# Altium project Furious_FFT.PrjPcb
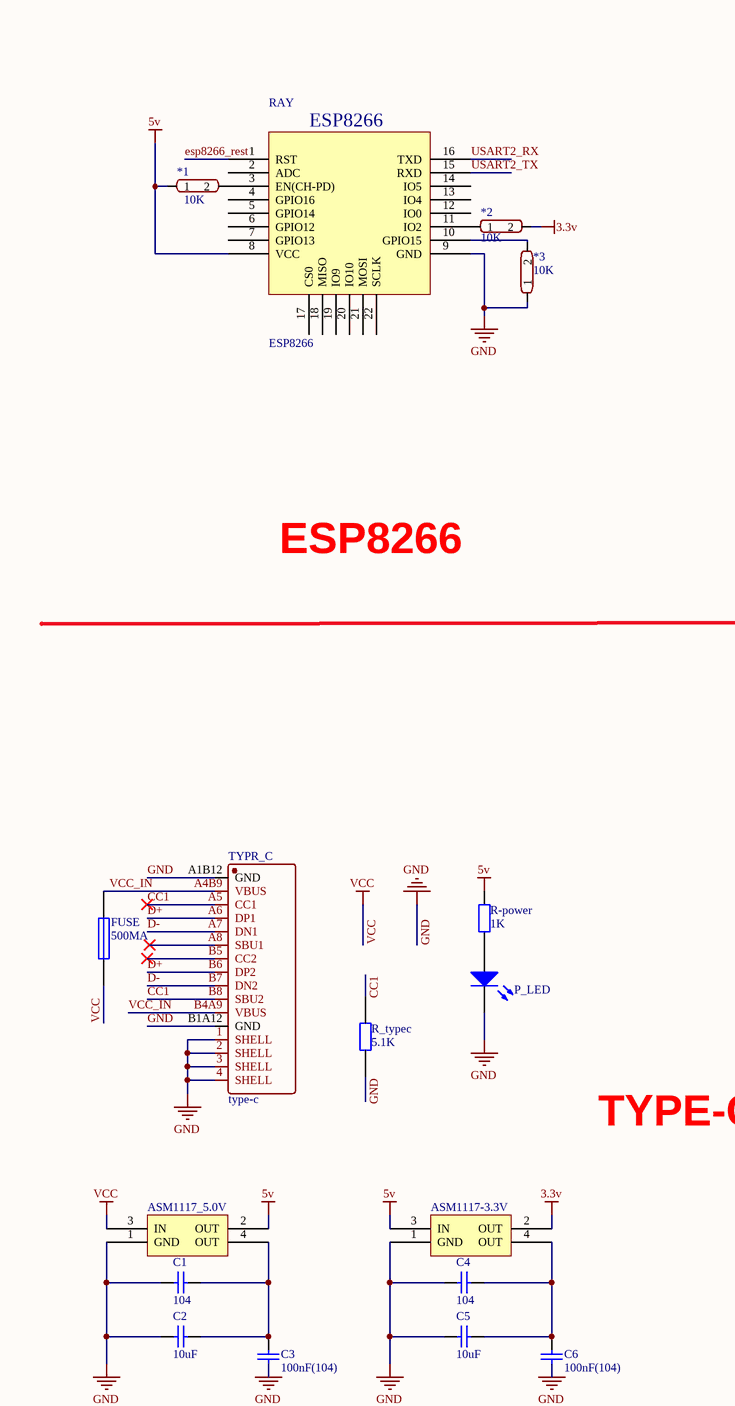
[diagram p0: Verison_1.0.SchDoc, top left]
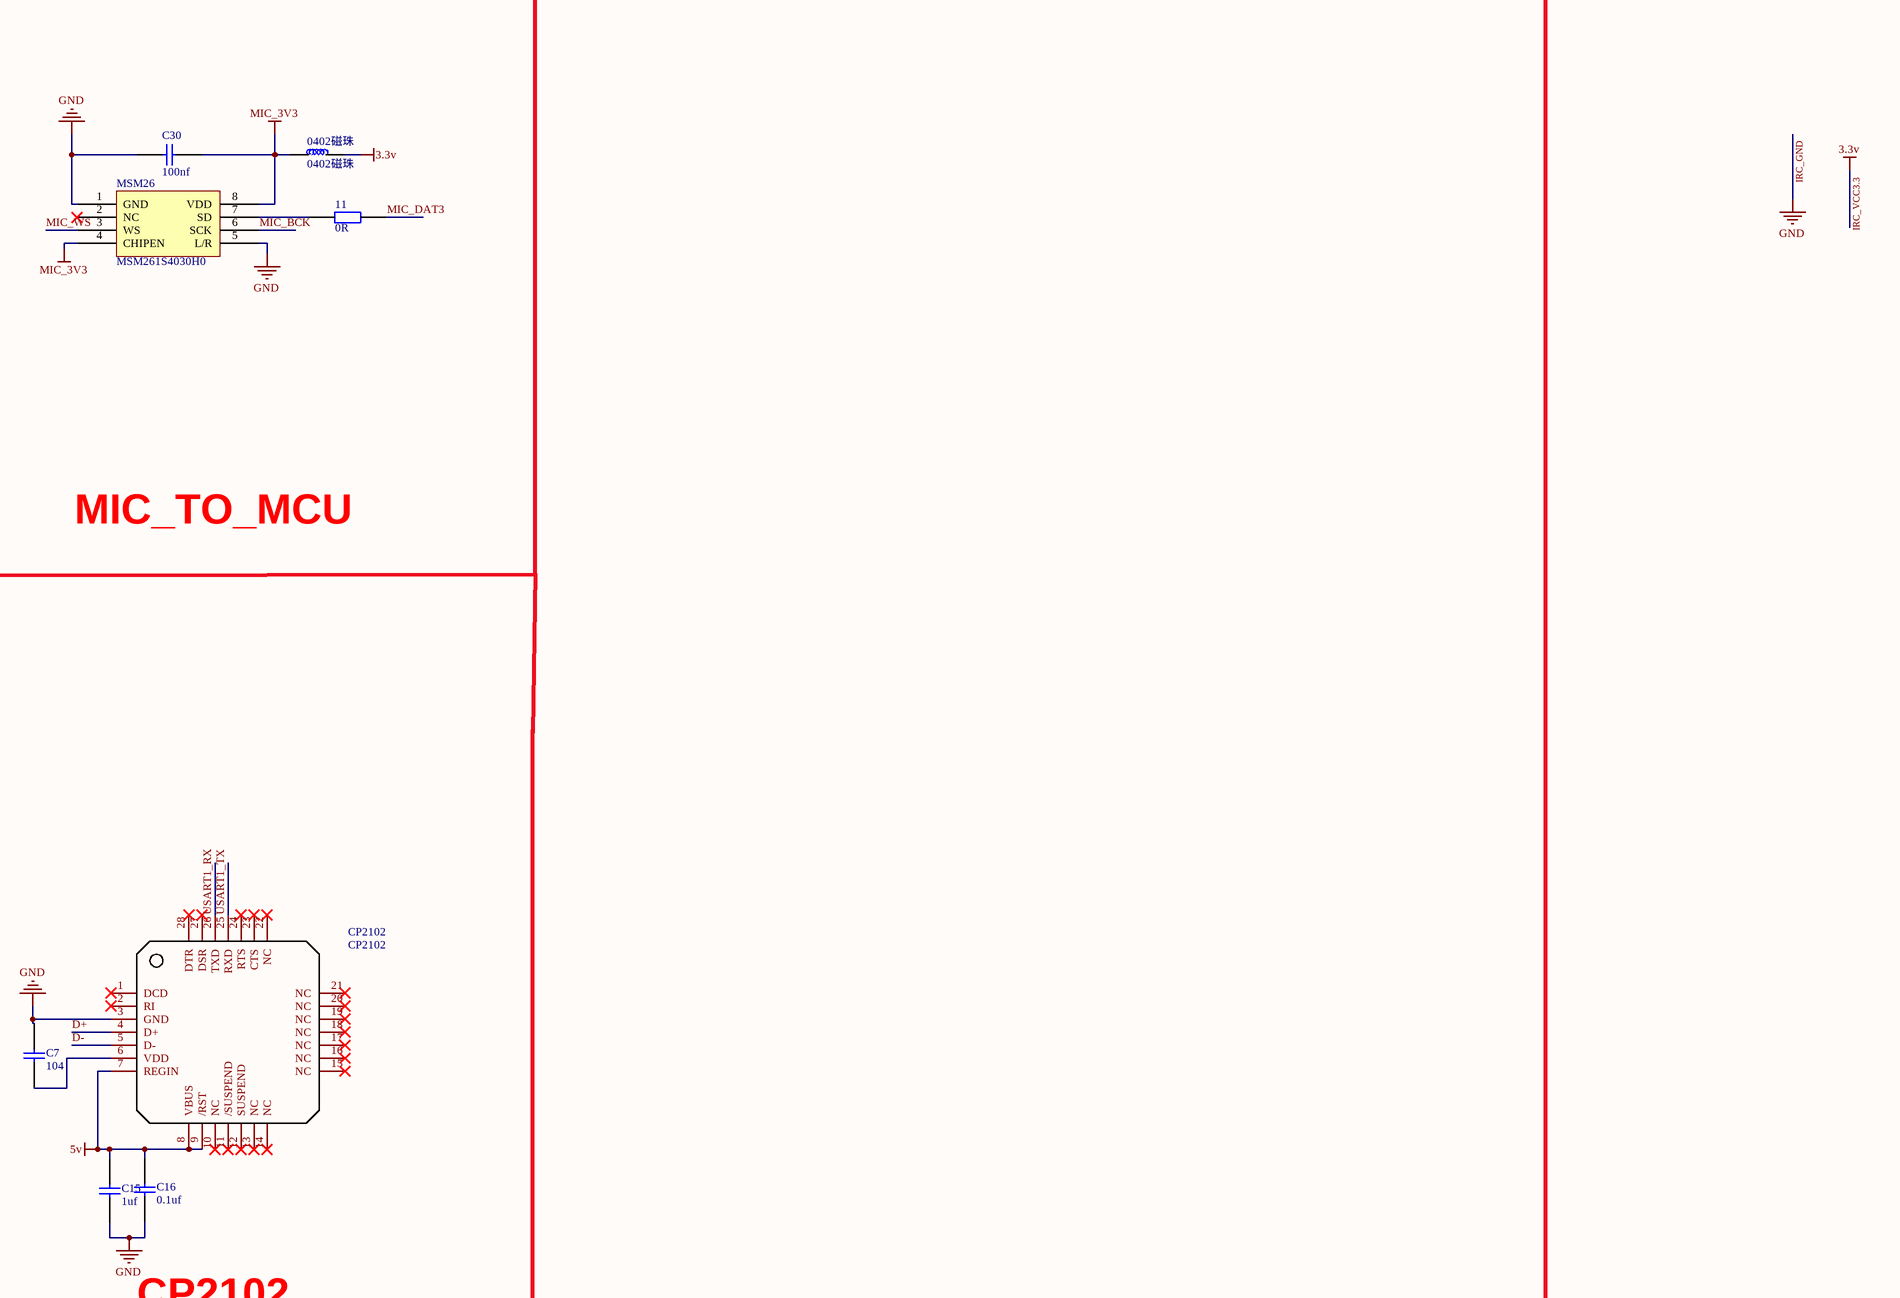
[diagram p1: Verison_1.0.SchDoc, top middle]
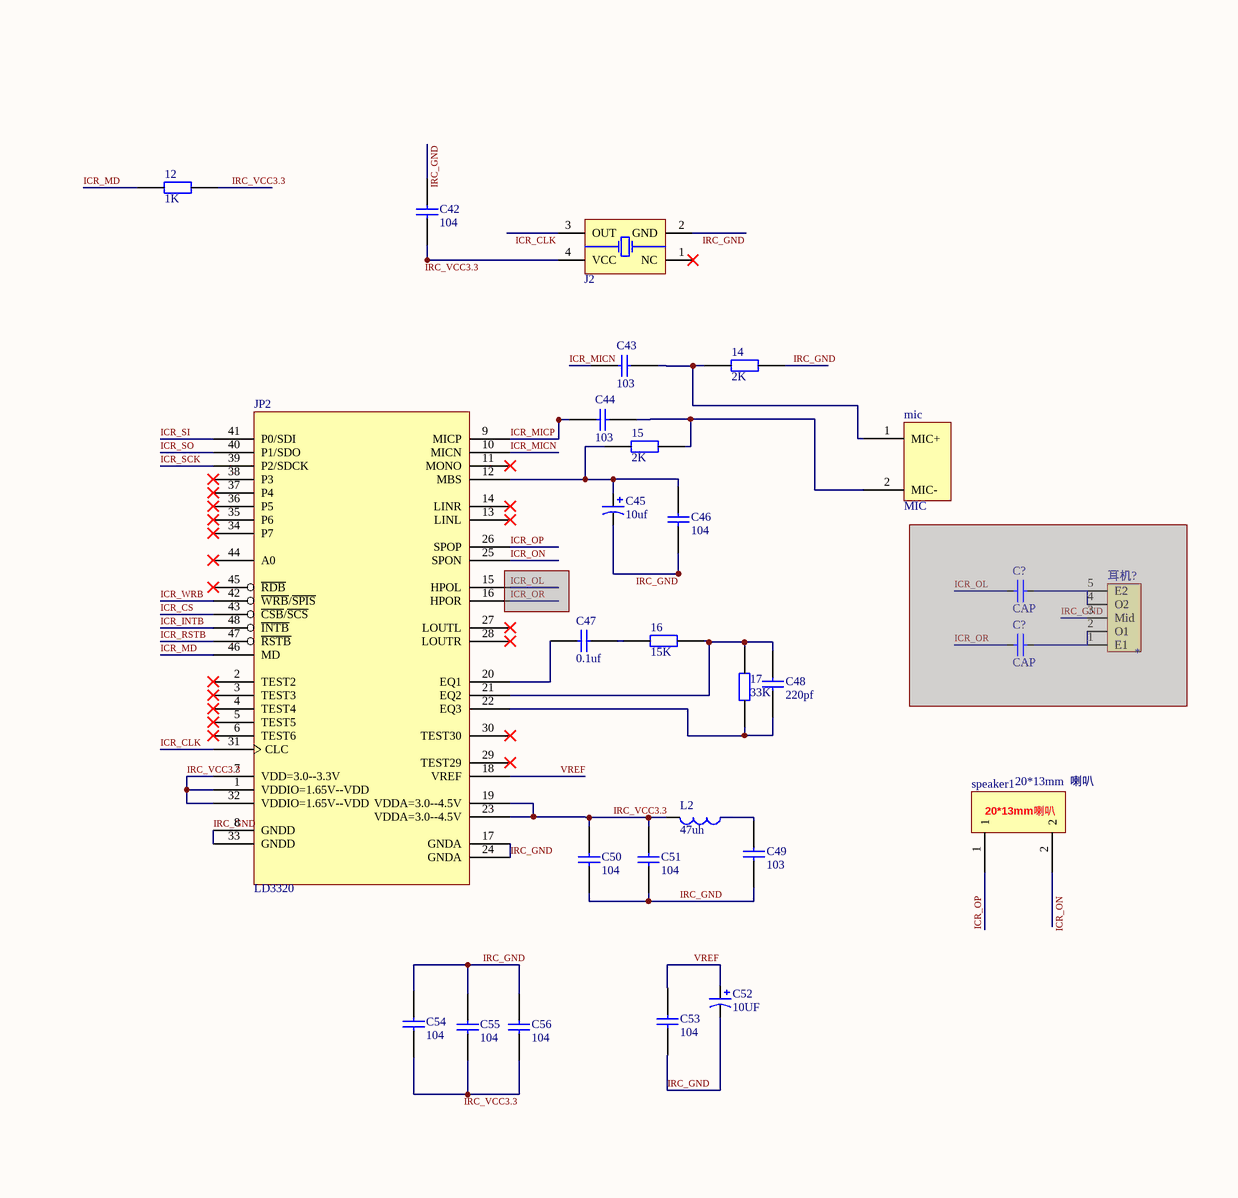
[diagram p2: Verison_1.0.SchDoc, top right]
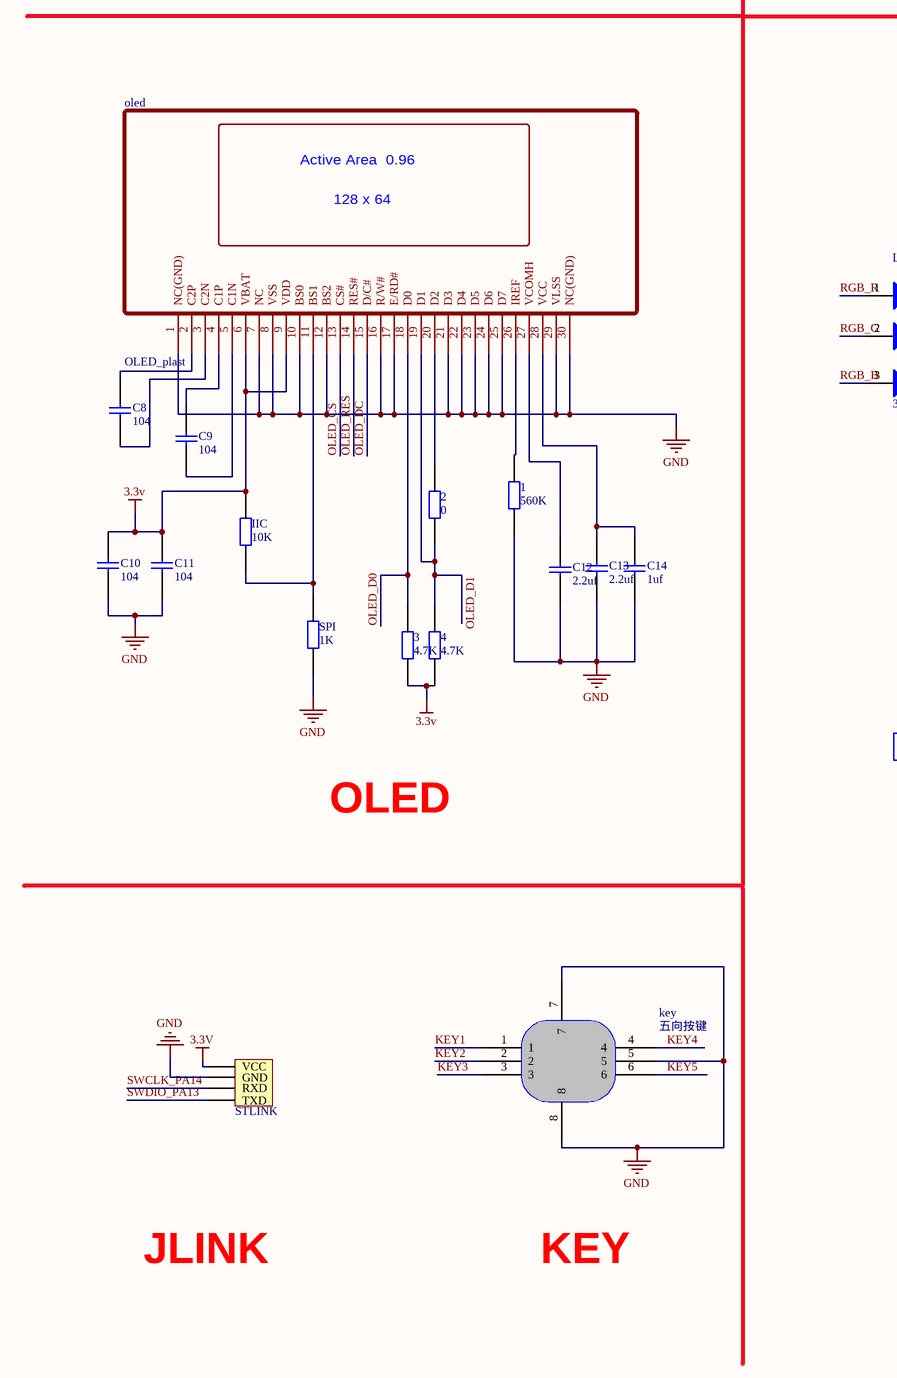
[diagram p3: Verison_1.0.SchDoc, bottom left]
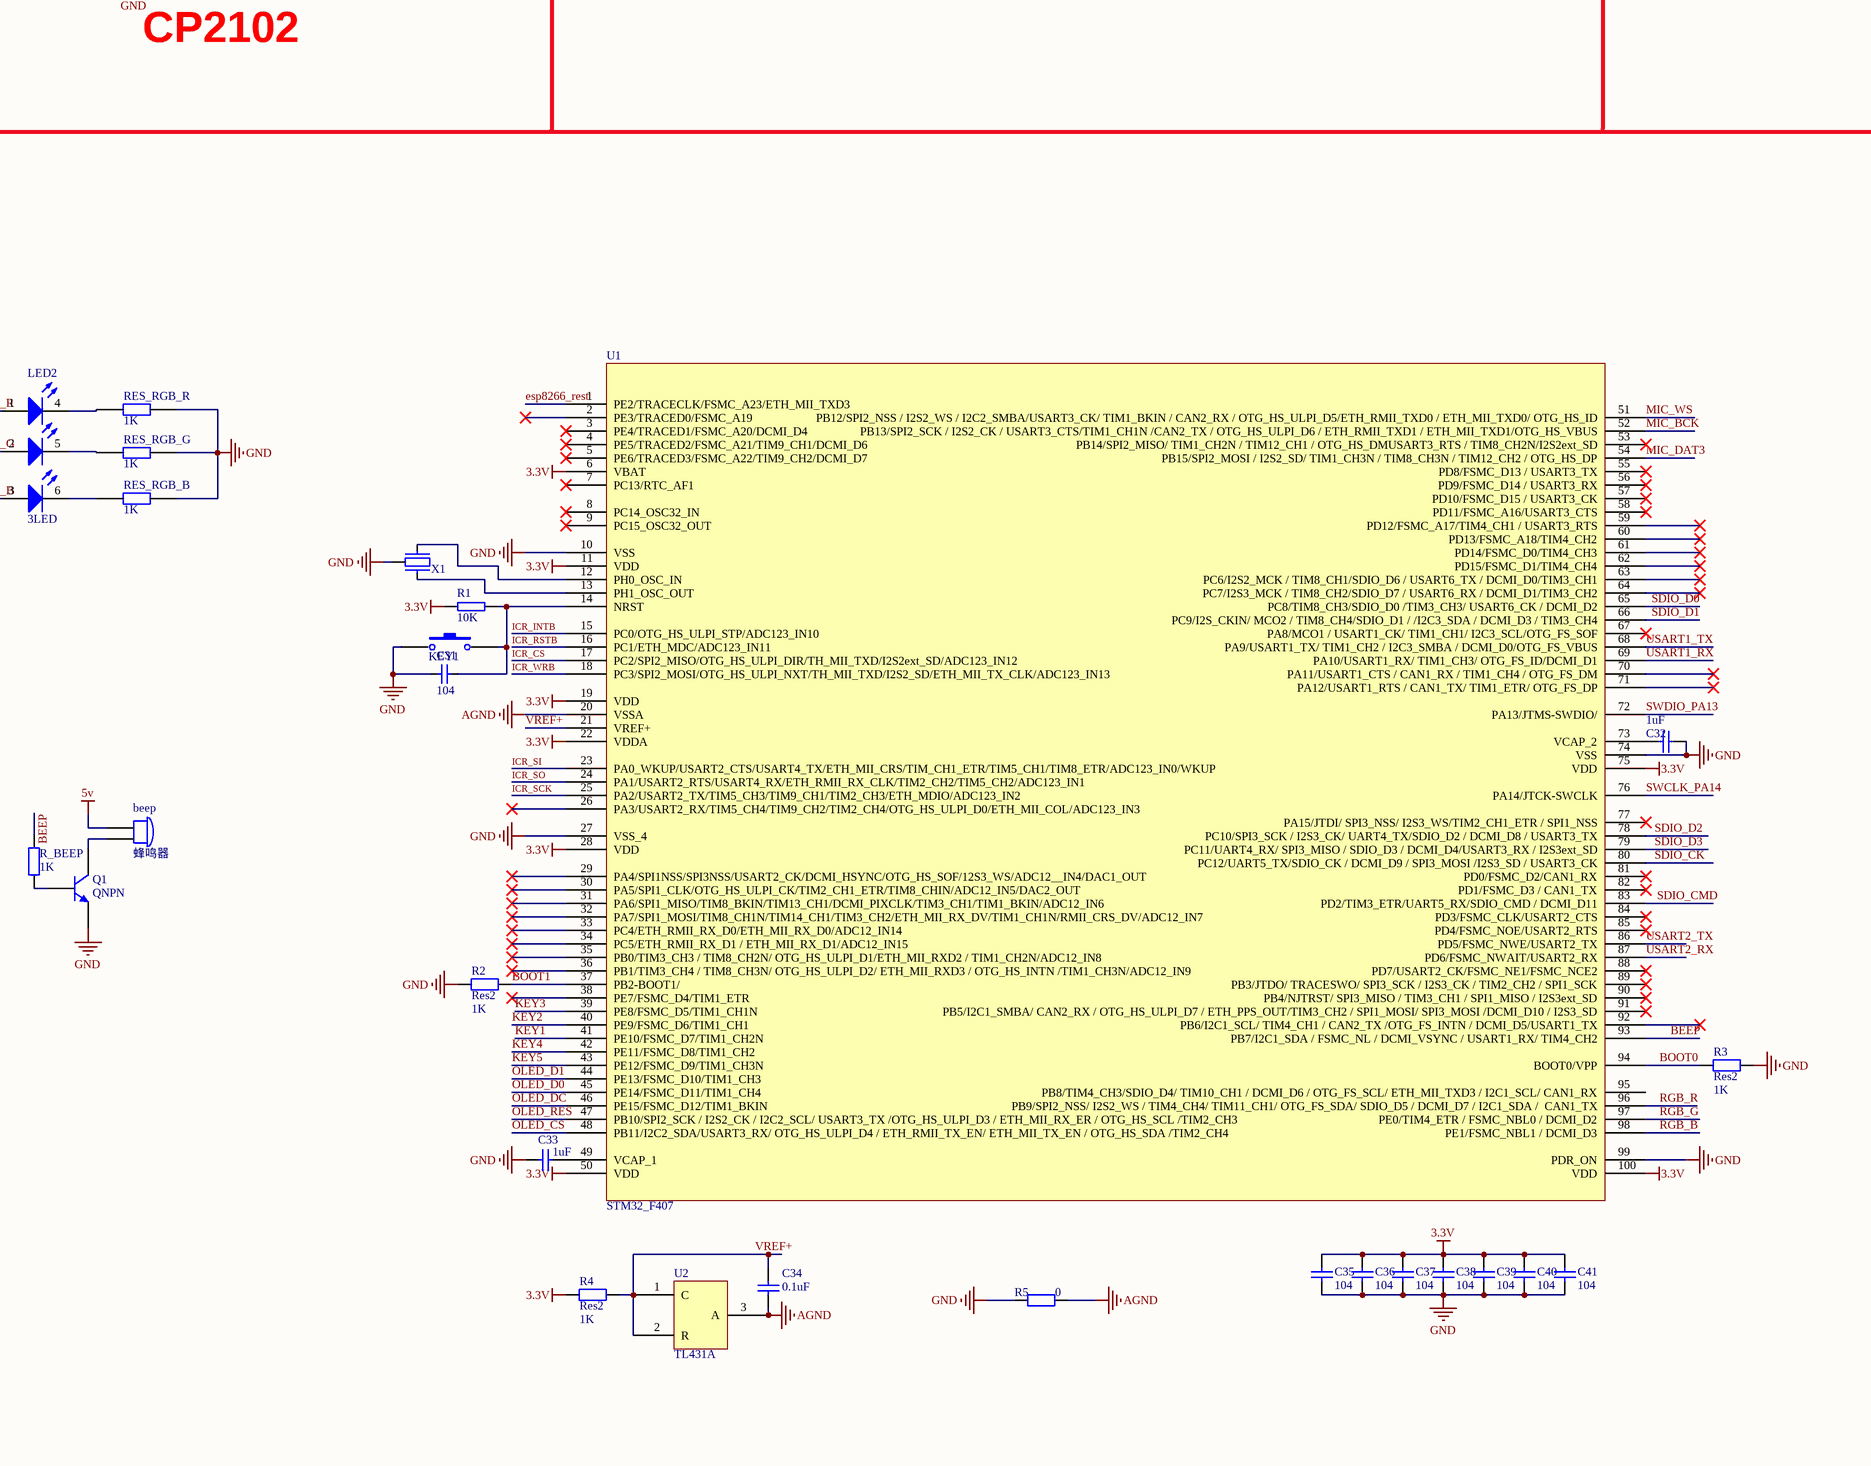
[diagram p4: Verison_1.0.SchDoc, bottom middle]
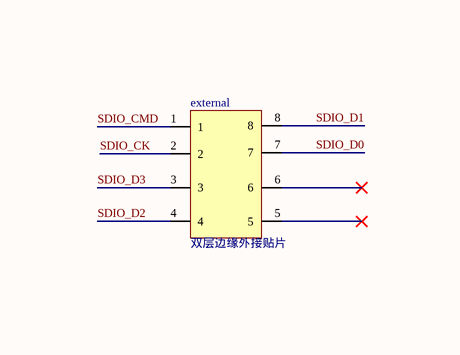
[diagram p5: Verison_1.0.SchDoc, bottom right]
1 sheet, 97 parts. Net scope: global (net labels, ports and power ports of the same name join across sheets).
Board file: Verison_1.1.PcbDoc

## Sheet Verison_1.0.SchDoc
size A1

### Parts
(Parts that share a designator on the sheet are numbered #1, #2 ... from top to bottom, then left to right.)
1  阻值: 560K  [0603]  (hidden comment: 电阻0603)
2  阻值: 0  [0603]  (hidden comment: 电阻0603)
3  阻值: 4.7K  [0603]  (hidden comment: 电阻0603)
4  阻值: 4.7K  [0603]  (hidden comment: 电阻0603)
11  阻值: 0R  [0603]  (hidden comment: 电阻0603)
12  阻值: 1K  [0603]  (hidden comment: 电阻0603)
14  阻值: 2K  [0603]  (hidden comment: 电阻0603)
15  阻值: 2K  [0603]  (hidden comment: 电阻0603)
16  阻值: 15K  [0603]  (hidden comment: 电阻0603)
17  阻值: 33K  [0603]  (hidden comment: 电阻0603)
0402磁珠  0402磁珠  [0402磁珠]
*1  res: 10K  [0603]  (hidden comment: RES-0603)
*2  res: 10K  [0603]  (hidden comment: RES-0603)
*3  res: 10K  [0603]  (hidden comment: RES-0603)
ASM1117-3.3V  ASM1117-3.3V  [SOT-223]  (value not drawn)
ASM1117_5.0V  ASM1117-5.0V  [SOT-223]  (value not drawn)
beep  蜂鸣器  [两脚蜂鸣器]
C1  value 104  [0805]  (hidden comment: Cap)
C2  value 10uF  [0805]  (hidden comment: Cap)
C3  value 100nF(104)  [0805]  (hidden comment: Cap)
C4  value 104  [0805]  (hidden comment: Cap)
C5  value 10uF  [0805]  (hidden comment: Cap)
C6  value 100nF(104)  [0805]  (hidden comment: Cap)
C7  104  [0603]
C8  104  [0603]
C9  104  [0603]
C10  104  [0603]
C11  104  [0603]
C12  2.2uf  [0603]
C13  2.2uf  [0603]
C14  1uf  [0603]
C15  1uf  [0603]
C16  0.1uf  [0603]
C30  100nf  [0603]
C31  CAP_22  [0603_C]  (value not drawn)
C32  value 1uF  [0603_C]  (hidden comment: Cap)
C33  value 1uF  [0603_C]  (hidden comment: Cap)
C34  value 0.1uF  [0603_C]  (hidden comment: Cap)
C35  104  [0603_C]
C36  104  [0603_C]
C37  104  [0603_C]
C38  104  [0603_C]
C39  104  [0603_C]
C40  104  [0603_C]
C41  104  [0603_C]
C42  104  [0603]
C43  103  [0603]
C44  103  [0603]
C45  10uf  [1206]
C46  104  [0603]
C47  0.1uf  [0603]
C48  220pf  [0603]
C49  103  [0603]
C50  104  [0603]
C51  104  [0603]
C52  10UF  [1206]
C53  104  [0603]
C54  104  [0603]
C55  104  [0603]
C56  104  [0603]
C?#1  CAP  [0805C]  (masked out: inside a compile mask, not in the netlist)
C?#2  CAP  [0805C]  (masked out: inside a compile mask, not in the netlist)
CP2102  CP2102  [CP2102]
external  双层边缘外接贴片  [外接贴片接口(无外框)]
FUSE  500MA  [1206]
IIC  阻值: 10K  [0603]  (hidden comment: 电阻0603)
J2  oscillator  [J有源晶振-正方]  (value not drawn)
JP2  LD3320  [QFN48]
key  五向按键  [五向按键]
KEY1  按键  [四角按键]  (value not drawn)
L2  47uh  [0805]
LED2  3LED  [三色LED]
mic  MIC  [贴片MIC头]
MSM26  MSM261S4030H0  [MSM261S4030H0 - duplicate]
oled  OLED_plast  [oled_plast]
P_LED  LED0  [0805LED]  (value not drawn)
Q1  QNPN  [SOT-23B_N]
R1  RES_10K  [0603_R]  (value not drawn)
R2  Res2  value 1K  [0603_R]
R3  Res2  value 1K  [0603_R]
R4  Res2  value 1K  [0603_R]
R5  value 0  [0603_R]  (hidden comment: Res2)
R-power  value 1K  [0805-1]  (hidden comment: Res1)
R_BEEP  value 1K  [0805-1]  (hidden comment: Res1)
R_typec  阻值: 5.1K  [0603]  (hidden comment: 电阻0603)
RAY  ESP8266  [esp8266]
RES_RGB_B  阻值: 1K  [0603]  (hidden comment: 电阻0603)
RES_RGB_G  阻值: 1K  [0603]  (hidden comment: 电阻0603)
RES_RGB_R  阻值: 1K  [0603]  (hidden comment: 电阻0603)
speaker1  20*13mm  喇叭  [20*13mm 喇叭]
SPI  阻值: 1K  [0603]  (hidden comment: 电阻0603)
STLINK  贴片蓝牙  [贴片蓝牙]  (value not drawn)
TYPR_C  type-c  [type-c]
U1  STM32_F407  [LQFP_100]
U2  TL431A  [SOT_23]
X1  XTAL_SMT  [XTAL_SMD]  (value not drawn)
耳机?  *  [耳机]  (masked out: inside a compile mask, not in the netlist)

### Nets
5v: *1.1 ASM1117-3.3V.3(IN) ASM1117_5.0V.2(OUT) beep.0 C15.1 C16.1 CP2102.7(REGIN) CP2102.8(VBUS) CP2102.9(/RST) R-power.1 RAY.8(VCC)
AGND: C34.1 R5.2 U1.20(VSSA) U2.3(A)
GND: 1.2 14.1 *3.1 ASM1117-3.3V.1(GND) ASM1117_5.0V.1(GND) C1.2 C2.2 C3.2 C4.2 C5.2 C6.2 C7.1 C10.2 C11.2 C12.2 C13.2 C14.2 C15.2 C16.2 C30.2 C31.1 C32.2 C33.1 C35.2 C36.2 C37.2 C38.2 C39.2 C40.2 C41.2 C42.1 C45.2 C46.2 C49.2 C50.2 C51.2 C52.2 C53.2 C54.1 C55.1 C56.1 CP2102.3(GND) J2.2(GND) JP2.8(GNDD) JP2.17(GNDA) JP2.24(GNDA) JP2.33(GNDD) key.5 key.7 key.8 KEY1.1 MSM26.1(GND) MSM26.5(L/R) oled.1(NC(GND)) oled.7(NC) oled.8(VSS) oled.10(BS0) oled.12(BS2) oled.16(R/W#) oled.17(E/RD#) oled.21(D3) oled.22(D4) oled.23(D5) oled.24(D6) oled.25(D7) oled.29(VLSS) oled.30(NC(GND)) P_LED.2(K) Q1.3(E) R2.1 R3.2 R5.1 R_typec.2 RAY.9(GND) RES_RGB_B.1 RES_RGB_G.1 RES_RGB_R.1 SPI.2 STLINK.2(GND) TYPR_C.1(SHELL) TYPR_C.2(SHELL) TYPR_C.3(SHELL) TYPR_C.4(SHELL) TYPR_C.A1B12(GND) TYPR_C.B1A12(GND) U1.10(VSS) U1.27(VSS_4) U1.74(VSS) U1.99(PDR_ON) X1.0  [also labelled IRC_GND]
IRC_VCC3.3: 3.2 4.2 12.1 0402磁珠.2 *2.2 ASM1117-3.3V.2(OUT) C10.1 C11.1 C35.1 C36.1 C37.1 C38.1 C39.1 C40.1 C41.1 C42.2 C50.1 C51.1 C54.2 C55.2 C56.2 IIC.1 J2.4(VCC) JP2.1(VDDIO=1.65V--VDD) JP2.7(VDD=3.0--3.3V) JP2.19(VDDA=3.0--4.5V) JP2.23(VDDA=3.0--4.5V) JP2.32(VDDIO=1.65V--VDD) L2.1 oled.6(VBAT) oled.9(VDD) R1.2 R4.1 STLINK.1(VCC) U1.6(VBAT) U1.11(VDD) U1.19(VDD) U1.22(VDDA) U1.28(VDD) U1.50(VDD) U1.75(VDD) U1.100(VDD)  [also labelled 3.3v]
MIC_3V3: 0402磁珠.1 C30.1 MSM26.4(CHIPEN) MSM26.8(VDD)
VCC: ASM1117_5.0V.3(IN) FUSE.2
BEEP: R_BEEP.2 U1.93(PB7/I2C1_SDA_/_FSMC_NL_/_DCMI_VSYNC_/_USART1_RX/_TIM4_CH2)
BOOT0: R3.1 U1.94(BOOT0/VPP)
BOOT1: R2.2 U1.37(PB2-BOOT1/)
CC1: R_typec.1 TYPR_C.A5(CC1) TYPR_C.B8(SBU2)
D+: CP2102.4(D+) TYPR_C.A6(DP1) TYPR_C.B6(DP2)
D-: CP2102.5(D-) TYPR_C.A7(DN1) TYPR_C.B7(DN2)
esp8266_rest: RAY.1(RST) U1.1(PE2/TRACECLK/FSMC_A23/ETH_MII_TXD3)
ICR_CLK: J2.3(OUT) JP2.31(CLC)
ICR_CS: JP2.43(~{CSB}/~{SCS}) U1.17(PC2/SPI2_MISO/OTG_HS_ULPI_DIR/TH_MII_TXD/I2S2ext_SD/ADC123_IN12)
ICR_INTB: JP2.48(~{INTB}) U1.15(PC0/OTG_HS_ULPI_STP/ADC123_IN10)
ICR_MD: 12.2 JP2.46(MD)
ICR_MICN: C43.2 JP2.10(MICN)
ICR_MICP: C44.2 JP2.9(MICP)
ICR_ON: JP2.25(SPON) speaker1.2
ICR_OP: JP2.26(SPOP) speaker1.1
ICR_RSTB: JP2.47(~{RSTB}) U1.16(PC1/ETH_MDC/ADC123_IN11)
ICR_SCK: JP2.39(P2/SDCK) U1.25(PA2/USART2_TX/TIM5_CH3/TIM9_CH1/TIM2_CH3/ETH_MDIO/ADC123_IN2)
ICR_SI: JP2.41(P0/SDI) U1.23(PA0_WKUP/USART2_CTS/USART4_TX/ETH_MII_CRS/TIM_CH1_ETR/TIM5_CH1/TIM8_ETR/ADC123_IN0/WKUP)
ICR_SO: JP2.40(P1/SDO) U1.24(PA1/USART2_RTS/USART4_RX/ETH_RMII_RX_CLK/TIM2_CH2/TIM5_CH2/ADC123_IN1)
ICR_WRB: JP2.42(~{WRB}/~{SPIS}) U1.18(PC3/SPI2_MOSI/OTG_HS_ULPI_NXT/TH_MII_TXD/I2S2_SD/ETH_MII_TX_CLK/ADC123_IN13)
KEY1: key.1 U1.41(PE10/FSMC_D7/TIM1_CH2N)
KEY2: key.2 U1.40(PE9/FSMC_D6/TIM1_CH1)
KEY3: key.3 U1.39(PE8/FSMC_D5/TIM1_CH1N)
KEY4: key.4 U1.42(PE11/FSMC_D8/TIM1_CH2)
KEY5: key.6 U1.43(PE12/FSMC_D9/TIM1_CH3N)
MIC_BCK: MSM26.6(SCK) U1.52(PB13/SPI2_SCK_/_I2S2_CK_/_USART3_CTS/TIM1_CH1N_/CAN2_TX_/_OTG_HS_ULPI_D6_/_ETH_RMII_TXD1_/_ETH_MII_TXD1/OTG_HS_VBUS)
MIC_DAT3: 11.1 U1.54(PB15/SPI2_MOSI_/_I2S2_SD/_TIM1_CH3N_/_TIM8_CH3N_/_TIM12_CH2_/_OTG_HS_DP)
MIC_WS: MSM26.3(WS) U1.51(PB12/SPI2_NSS_/_I2S2_WS_/_I2C2_SMBA/USART3_CK/_TIM1_BKIN_/_CAN2_RX_/_OTG_HS_ULPI_D5/ETH_RMII_TXD0_/_ETH_MII_TXD0/_OTG_HS_ID)
OLED_CS: oled.13(CS#) U1.48(PB11/I2C2_SDA/USART3_RX/_OTG_HS_ULPI_D4_/_ETH_RMII_TX_EN/_ETH_MII_TX_EN_/_OTG_HS_SDA_/TIM2_CH4)
OLED_D0: 3.1 oled.18(D0) U1.45(PE14/FSMC_D11/TIM1_CH4)
OLED_D1: 2.2 4.1 oled.19(D1) U1.44(PE13/FSMC_D10/TIM1_CH3)
OLED_DC: oled.15(D/C#) U1.46(PE15/FSMC_D12/TIM1_BKIN)
OLED_RES: oled.14(RES#) U1.47(PB10/SPI2_SCK_/_I2S2_CK_/_I2C2_SCL/_USART3_TX_/OTG_HS_ULPI_D3_/_ETH_MII_RX_ER_/_OTG_HS_SCL_/TIM2_CH3)
RGB_B: LED2.3(A) U1.98(PE1/FSMC_NBL1_/_DCMI_D3)
RGB_G: LED2.2(A) U1.97(PE0/TIM4_ETR_/_FSMC_NBL0_/_DCMI_D2)
RGB_R: LED2.1(A) U1.96(PB9/SPI2_NSS/_I2S2_WS_/_TIM4_CH4/_TIM11_CH1/_OTG_FS_SDA/_SDIO_D5_/_DCMI_D7_/_I2C1_SDA_/__CAN1_TX)
SDIO_CK: external.2 U1.80(PC12/UART5_TX/SDIO_CK_/_DCMI_D9_/_SPI3_MOSI_/I2S3_SD_/_USART3_CK)
SDIO_CMD: external.1 U1.83(PD2/TIM3_ETR/UART5_RX/SDIO_CMD_/_DCMI_D11)
SDIO_D0: external.7 U1.65(PC8/TIM8_CH3/SDIO_D0_/TIM3_CH3/_USART6_CK_/_DCMI_D2)
SDIO_D1: external.8 U1.66(PC9/I2S_CKIN/_MCO2_/_TIM8_CH4/SDIO_D1_/_/I2C3_SDA_/_DCMI_D3_/_TIM3_CH4)
SDIO_D2: external.4 U1.78(PC10/SPI3_SCK_/_I2S3_CK/_UART4_TX/SDIO_D2_/_DCMI_D8_/_USART3_TX)
SDIO_D3: external.3 U1.79(PC11/UART4_RX/_SPI3_MISO_/_SDIO_D3_/_DCMI_D4/USART3_RX_/_I2S3ext_SD)
SWCLK_PA14: STLINK.3(RXD) U1.76(PA14/JTCK-SWCLK)
SWDIO_PA13: STLINK.4(TXD) U1.72(PA13/JTMS-SWDIO/)
USART1_RX: CP2102.26(TXD) U1.69(PA10/USART1_RX/_TIM1_CH3/_OTG_FS_ID/DCMI_D1)
USART1_TX: CP2102.25(RXD) U1.68(PA9/USART1_TX/_TIM1_CH2_/_I2C3_SMBA_/_DCMI_D0/OTG_FS_VBUS)
USART2_RX: RAY.16(TXD) U1.87(PD6/FSMC_NWAIT/USART2_RX)
USART2_TX: RAY.15(RXD) U1.86(PD5/FSMC_NWE/USART2_TX)
VCC_IN: FUSE.1 TYPR_C.A4B9(VBUS) TYPR_C.B4A9(VBUS)
VREF: C52.1 C53.1 JP2.18(VREF)
VREF+: C34.2 R4.2 U1.21(VREF+) U2.1(C) U2.2(R)
Net1_1: 1.1 oled.26(IREF)
Net2_1: 2.1 oled.20(D2)
Net11_2: 11.2 MSM26.7(SD)
Net14_2: 14.2 C43.1 mic.1(MIC+)
Net15_1: 15.1 C44.1 mic.2(MIC-)
Net15_2: 15.2 C45.1 C46.1 JP2.12(MBS)
Net16_1: 16.1 17.1 C48.1 JP2.21(EQ2)
Net16_2: 16.2 C47.1
Net17_2: 17.2 C48.2 JP2.22(EQ3)
Net*1_2: *1.2 RAY.3(EN(CH-PD))
Net*2_1: *2.1 RAY.11(IO2)
Net*3_2: *3.2 RAY.10(GPIO15)
NetASM1117-3.3V_4: ASM1117-3.3V.4(OUT) C4.1 C5.1 C6.1
NetASM1117_5.0V_4: ASM1117_5.0V.4(OUT) C1.1 C2.1 C3.1
Netbeep_1: beep.1 Q1.1(C)
NetC7_2: C7.2 CP2102.6(VDD)
NetC8_1: C8.1 oled.2(C2P)
NetC8_2: C8.2 oled.3(C2N)
NetC9_1: C9.1 oled.4(C1P)
NetC9_2: C9.2 oled.5(C1N)
NetC12_1: C12.1 oled.27(VCOMH)
NetC13_1: C13.1 C14.1 oled.28(VCC)
NetC31_2: C31.2 KEY1.2 R1.1 U1.14(NRST)
NetC32_1: C32.1 U1.73(VCAP_2)
NetC33_2: C33.2 U1.49(VCAP_1)
NetC47_2: C47.2 JP2.20(EQ1)
NetC49_1: C49.1 L2.2
NetIIC_2: IIC.2 oled.11(BS1) SPI.1
NetLED2_4: LED2.4(K) RES_RGB_R.2
NetLED2_5: LED2.5(K) RES_RGB_G.2
NetLED2_6: LED2.6(K) RES_RGB_B.2
NetP_LED_1: P_LED.1(A) R-power.2
NetQ1_2: Q1.2(B) R_BEEP.1
NetU1_12: U1.12(PH0_OSC_IN) X1.2
NetU1_13: U1.13(PH1_OSC_OUT) X1.1

Not connected (* = marked no-connect by the designer): CP2102 1(DCD)* 2(RI)* 10(NC)* 11(/SUSPEND)* 12(SUSPEND)* 13(NC)* 14(NC)* 15(NC)* 16(NC)* 17(NC)* 18(NC)* 19(NC)* 20(NC)* 21(NC)* 22(NC)* 23(CTS)* 24(RTS)* 27(DSR)* 28(DTR)*; external 5* 6*; J2 1(NC)*; JP2 2(TEST2)* 3(TEST3)* 4(TEST4)* 5(TEST5)* 6(TEST6)* 11(MONO)* 13(LINL)* 14(LINR)* 15(HPOL) 16(HPOR) 27(LOUTL)* 28(LOUTR)* 29(TEST29)* 30(TEST30)* 34(P7)* 35(P6)* 36(P5)* 37(P4)* 38(P3)* 44(A0)* 45(~{RDB})*; MSM26 2(NC)*; RAY 2(ADC) 4(GPIO16) 5(GPIO14) 6(GPIO12) 7(GPIO13) 12(IO0) 13(IO4) 14(IO5) 17(CS0) 18(MISO) 19(IO9) 20(IO10) 21(MOSI) 22(SCLK); TYPR_C A8(SBU1)* B5(CC2)*; U1 2(PE3/TRACED0/FSMC_A19)* 3(PE4/TRACED1/FSMC_A20/DCMI_D4)* 4(PE5/TRACED2/FSMC_A21/TIM9_CH1/DCMI_D6)* 5(PE6/TRACED3/FSMC_A22/TIM9_CH2/DCMI_D7)* 7(PC13/RTC_AF1)* 8(PC14_OSC32_IN)* 9(PC15_OSC32_OUT)* 26(PA3/USART2_RX/TIM5_CH4/TIM9_CH2/TIM2_CH4/OTG_HS_ULPI_D0/ETH_MII_COL/ADC123_IN3)* 29(PA4/SPI1NSS/SPI3NSS/USART2_CK/DCMI_HSYNC/OTG_HS_SOF/12S3_WS/ADC12__IN4/DAC1_OUT)* 30(PA5/SPI1_CLK/OTG_HS_ULPI_CK/TIM2_CH1_ETR/TIM8_CHIN/ADC12_IN5/DAC2_OUT)* 31(PA6/SPI1_MISO/TIM8_BKIN/TIM13_CH1/DCMI_PIXCLK/TIM3_CH1/TIM1_BKIN/ADC12_IN6)* 32(PA7/SPI1_MOSI/TIM8_CH1N/TIM14_CH1/TIM3_CH2/ETH_MII_RX_DV/TIM1_CH1N/RMII_CRS_DV/ADC12_IN7)* 33(PC4/ETH_RMII_RX_D0/ETH_MII_RX_D0/ADC12_IN14)* 34(PC5/ETH_RMII_RX_D1_/_ETH_MII_RX_D1/ADC12_IN15)* 35(PB0/TIM3_CH3_/_TIM8_CH2N/_OTG_HS_ULPI_D1/ETH_MII_RXD2_/_TIM1_CH2N/ADC12_IN8)* 36(PB1/TIM3_CH4_/_TIM8_CH3N/_OTG_HS_ULPI_D2/_ETH_MII_RXD3_/_OTG_HS_INTN_/TIM1_CH3N/ADC12_IN9)* 38(PE7/FSMC_D4/TIM1_ETR)* 53(PB14/SPI2_MISO/_TIM1_CH2N_/_TIM12_CH1_/_OTG_HS_DMUSART3_RTS_/_TIM8_CH2N/I2S2ext_SD)* 55(PD8/FSMC_D13_/_USART3_TX)* 56(PD9/FSMC_D14_/_USART3_RX)* 57(PD10/FSMC_D15_/_USART3_CK)* 58(PD11/FSMC_A16/USART3_CTS)* 59(PD12/FSMC_A17/TIM4_CH1_/_USART3_RTS)* 60(PD13/FSMC_A18/TIM4_CH2)* 61(PD14/FSMC_D0/TIM4_CH3)* 62(PD15/FSMC_D1/TIM4_CH4)* 63(PC6/I2S2_MCK_/_TIM8_CH1/SDIO_D6_/_USART6_TX_/_DCMI_D0/TIM3_CH1)* 64(PC7/I2S3_MCK_/_TIM8_CH2/SDIO_D7_/_USART6_RX_/_DCMI_D1/TIM3_CH2)* 67(PA8/MCO1_/_USART1_CK/_TIM1_CH1/_I2C3_SCL/OTG_FS_SOF)* 70(PA11/USART1_CTS_/_CAN1_RX_/_TIM1_CH4_/_OTG_FS_DM)* 71(PA12/USART1_RTS_/_CAN1_TX/_TIM1_ETR/_OTG_FS_DP)* 77(PA15/JTDI/_SPI3_NSS/_I2S3_WS/TIM2_CH1_ETR_/_SPI1_NSS)* 81(PD0/FSMC_D2/CAN1_RX)* 82(PD1/FSMC_D3_/_CAN1_TX)* 84(PD3/FSMC_CLK/USART2_CTS)* 85(PD4/FSMC_NOE/USART2_RTS)* 88(PD7/USART2_CK/FSMC_NE1/FSMC_NCE2)* 89(PB3/JTDO/_TRACESWO/_SPI3_SCK_/_I2S3_CK_/_TIM2_CH2_/_SPI1_SCK)* 90(PB4/NJTRST/_SPI3_MISO_/_TIM3_CH1_/_SPI1_MISO_/_I2S3ext_SD)* 91(PB5/I2C1_SMBA/_CAN2_RX_/_OTG_HS_ULPI_D7_/_ETH_PPS_OUT/TIM3_CH2_/_SPI1_MOSI/_SPI3_MOSI_/DCMI_D10_/_I2S3_SD)* 92(PB6/I2C1_SCL/_TIM4_CH1_/_CAN2_TX_/OTG_FS_INTN_/_DCMI_D5/USART1_TX)* 95(PB8/TIM4_CH3/SDIO_D4/_TIM10_CH1_/_DCMI_D6_/_OTG_FS_SCL/_ETH_MII_TXD3_/_I2C1_SCL/_CAN1_RX)

### Notes on the sheet
- ESP8266
- MIC_TO_MCU
- TYPE-C
- CP2102
- OLED
- JLINK
- KEY
- Labels drawn without touching a wire or pin: IRC_VCC3.3
- (in symbol 20*13mm  喇叭) 20*13mm喇叭
- (in symbol CAP_22) 104
- (in symbol OLED_plast) Active Area  0.96; 128 x 64
- (in symbol RES_10K) 10K

### Library data of the parts
ASM1117-3.3V ASM1117_5.0V = ASM1117: 3.3V稳压芯片
C1-C6 = Cap: 无极性电容; Published: 8-Jun-2000; LatestRevisionDate: 17-Jul-2002; LatestRevisionNote: Re-released for DXP Platform.; PackageReference: RAD-0.3; Publisher: Altium Limited
C7-C16 C30 C42-C44 C46-C51 C53-C56 = 电容0603
C32-C34 = Cap: Capacitor; Published: 8-Jun-2000; LatestRevisionDate: 17-Jul-2002; LatestRevisionNote: Re-released for DXP Platform.; PackageReference: RAD-0.3; Publisher: Altium Limited; PackageDescription: Radial Cap, Thru-Hole; 2 Leads; 0.3 in Pin Spacing
C35-C41 = CAP: Capacitor; Value: 20pF
C45 C52 = Cap Pol2: 电解电容; Published: 8-Jun-2000; LatestRevisionDate: 17-Jul-2002; LatestRevisionNote: Re-released for DXP Platform.; PackageReference: POLAR0.8; Publisher: Altium Limited
FUSE = Fuse
J2 = J晶振 有源
L2 = L
LED2 = 三色LED
P_LED = LED0: 发光二极管; Published: 8-Jun-2000; LatestRevisionDate: 08-Jul-2005; LatestRevisionNote: Mech Layer 1 removed.; PackageReference: LED-0; Publisher: Altium Limited
Q1 = QNPN: NPN Bipolar Transistor; Published: 8-Jun-2000; LatestRevisionDate: 29-May-2009; LatestRevisionNote: IPC-7351 Footprint Added.; PackageVersion: Aug-1999; PackageReference: SOT-23B; Publisher: Altium Limited; PackageDescription: 3-Pin SOT-23 Package 0.95 mm Pitch, 2.4 mm Lead Span
R2-R5 = Res2: Resistor; Published: 8-Jun-2000; LatestRevisionDate: 17-Jul-2002; LatestRevisionNote: Re-released for DXP Platform.; PackageReference: AXIAL-0.4; Publisher: Altium Limited; PackageDescription: Axial Device, Thru-Hole; 2 Leads; 0.4 in Pin Spacing
R-power R_BEEP = Res1: 贴片电阻; Published: 8-Jun-2000; LatestRevisionDate: 17-Jul-2002; LatestRevisionNote: Re-released for DXP Platform.; PackageReference: AXIAL-0.4; Publisher: Altium Limited
U1 = STM32_F40X
耳机? = 耳机接口: Comme: 耳机